# EAGLE design button_microcontroller_side (EAGLE 9.3.0)
PulcherButton 4.0 Microcontroller Side Jan Naef 190115
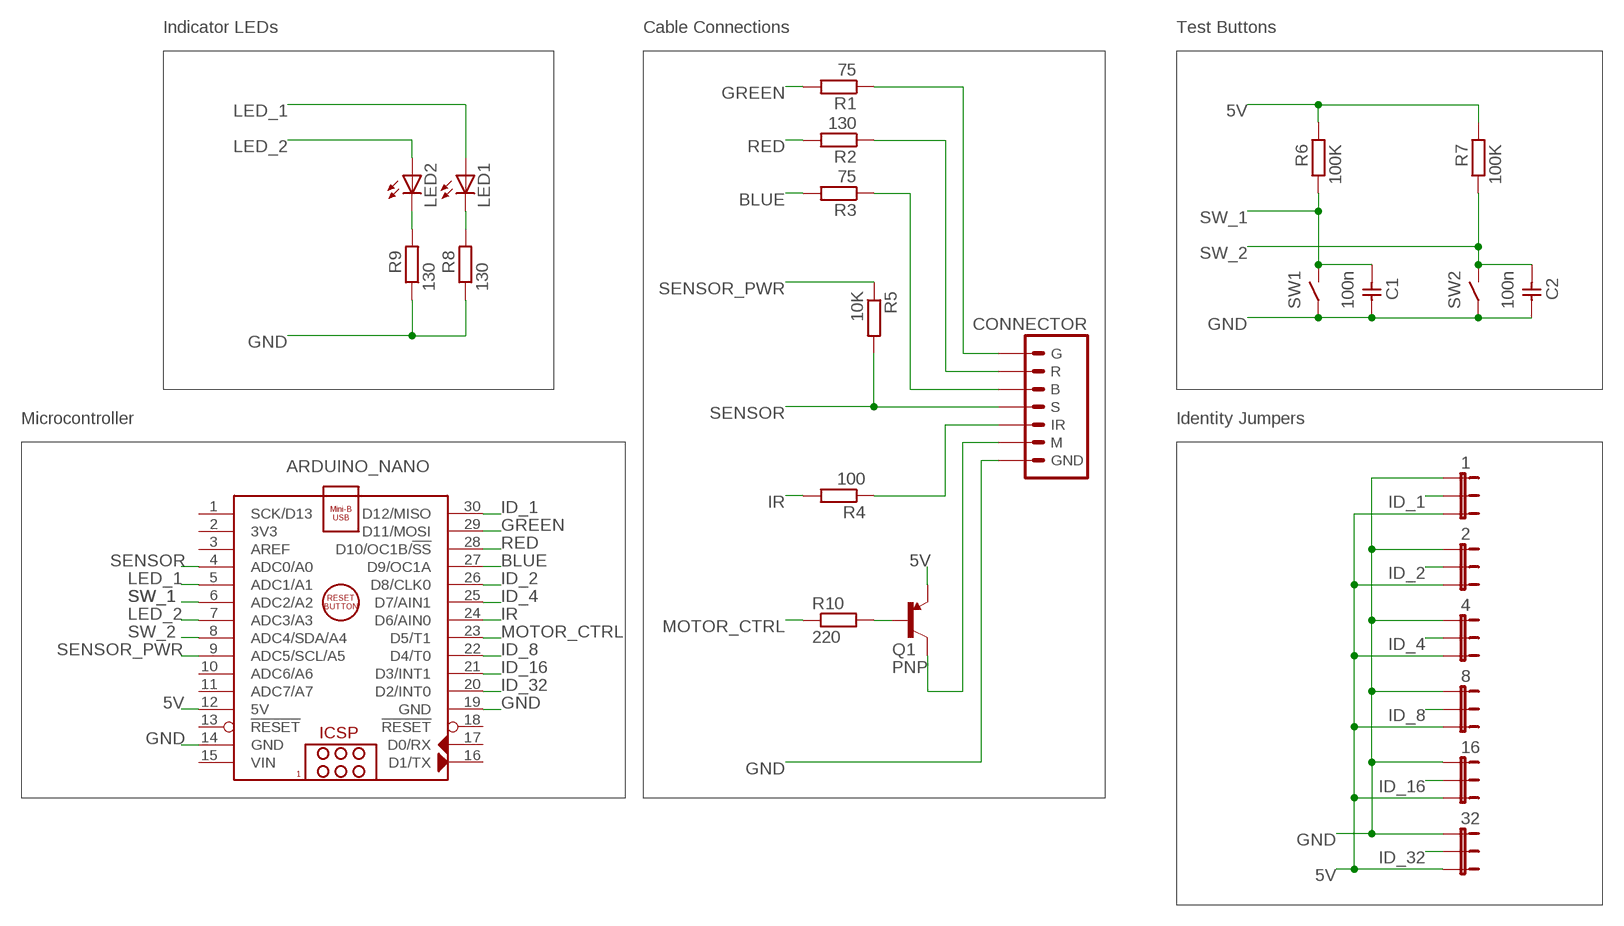
[diagram p0: schematic, sheet 1]

## Parts
1  JP2E  [JP2]
2  JP2E  [JP2]
4  JP2E  [JP2]
8  JP2E  [JP2]
16  JP2E  [JP2]
32  JP2E  [JP2]
ARDUINO_NANO  ARDUINO_NANO  [ARDUINO_NANO]
C1  100n  CAPACITOR  [CAPACITOR]
C2  100n  CAPACITOR  [CAPACITOR]
CONNECTOR  CONNECTOR_PADSHOLES  [CONNECTOR_ARDUINO_SIDE]
LED1  LED_3MM  [TCR5000_IR_EMITTER]
LED2  LED_3MM  [TCR5000_IR_EMITTER]
Q1  PNP  [TO92-]
R1  75  R-EU_0204/7  [0204/7]
R2  130  R-EU_0204/7  [0204/7]
R3  75  R-EU_0204/7  [0204/7]
R4  100  R-EU_0204/7  [0204/7]
R5  10K  R-EU_0204/7  [0204/7]
R6  100K  R-EU_0204/7  [0204/7]
R7  100K  R-EU_0204/7  [0204/7]
R8  130  R-EU_0204/7  [0204/7]
R9  130  R-EU_0204/7  [0204/7]
R10  220  R-EU_0204/7  [0204/7]
SW1  BUTTON  [KS-01Q-01_BUTTON]
SW2  BUTTON  [KS-01Q-01_BUTTON]

## Nets
5V: 1.3 2.3 4.3 8.3 16.3 32.3 ARDUINO_NANO.12(5V) Q1.E R6.2 R7.2
BLUE: ARDUINO_NANO.27(D9/OC1A) R3.2
GND: 1.1 2.1 4.1 8.1 16.1 32.1 ARDUINO_NANO.14(GND) ARDUINO_NANO.19(GND) C1.P$1 C2.P$1 CONNECTOR.GND R8.1 R9.1 SW1.1 SW1.3 SW2.1 SW2.3
GREEN: ARDUINO_NANO.29(D11/MOSI) R1.2
ID_1: 1.2 ARDUINO_NANO.30(D12/MISO)
ID_2: 2.2 ARDUINO_NANO.26(D8/CLK0)
ID_4: 4.2 ARDUINO_NANO.25(D7/AIN1)
ID_8: 8.2 ARDUINO_NANO.22(D4/T0)
ID_16: 16.2 ARDUINO_NANO.21(D3/INT1)
ID_32: 32.2 ARDUINO_NANO.20(D2/INT0)
IR: ARDUINO_NANO.24(D6/AIN0) R4.2
LED_1: ARDUINO_NANO.5(ADC1/A1) LED1.A
LED_2: ARDUINO_NANO.7(ADC3/A3) LED2.A
MOTOR [motor]: CONNECTOR.M Q1.C
MOTOR_CTRL: ARDUINO_NANO.23(D5/T1) R10.1
N$6: CONNECTOR.IR R4.1
N$7: CONNECTOR.B R3.1
N$8: CONNECTOR.R R2.1
N$14: CONNECTOR.G R1.1
N$19: LED1.C R8.2
N$20: LED2.C R9.2
N$21: Q1.B R10.2
RED: ARDUINO_NANO.28(D10/OC1B/!SS) R2.2
SENSOR: ARDUINO_NANO.4(ADC0/A0) CONNECTOR.S R5.2
SENSOR_PWR: ARDUINO_NANO.9(ADC5/SCL/A5) R5.1
SW_1: ARDUINO_NANO.6(ADC2/A2) C1.P$2 R6.1 SW1.2 SW1.4
SW_2: ARDUINO_NANO.8(ADC4/SDA/A4) C2.P$2 R7.1 SW2.2 SW2.4
Unconnected: ARDUINO_NANO.1(SCK/D13) ARDUINO_NANO.2(3V3) ARDUINO_NANO.3(AREF) ARDUINO_NANO.10(ADC6/A6) ARDUINO_NANO.11(ADC7/A7) ARDUINO_NANO.13(!RESET) ARDUINO_NANO.16(D1/TX) ARDUINO_NANO.17(D0/RX) ARDUINO_NANO.18(!RESET)

## Notes on the sheet
- Indicator LEDs | Cable Connections | Test Buttons
- Microcontroller | Identity Jumpers

## Power pins joined to a net without a drawn wire
VIN: ARDUINO_NANO.15(VIN)

## Library data of the parts
1 2 4 8 16 32 = Skinner_Box_Devices:JP2E: JUMPER
ARDUINO_NANO = Skinner_Box_Devices:ARDUINO_NANO: Arduino Nano V3.0 Module Overview: The Arduino Nano is a small, complete, and breadboard-friendly board based on the ATmega328 (Arduino Nano 3.x) or ATmega168 (Arduino Nano 2.x). It has more or less the same functionality of the Arduino Duemilanove, but in a different package. It lacks only a DC power jack, and works with a Mini-B USB cable instead of a standard one. The Nano was designed and is being produced by Gravitech <http://www.gravitech.us/arna30wiatp.html>. General specifications: Item Value Microcontroller Atmel ATmega168 or ATmega328 Operating Voltage (logic level) 5 V Input Voltage (recommended) 7-12 V Input Voltage (limits) 6-20 V Digital I/O Pins 14 (of which 6 provide PWM output) Analog Input Pins 8 DC Current per I/O Pin 40 mA Flash Memory 16 KB (ATmega168) or 32 KB (ATmega328) of which 2 KB used by bootloader SRAM 1 KB (ATmega168) or 2 KB (ATmega328) EEPROM 512 bytes (ATmega168) or 1 KB (ATmega328) Clock Speed 16 MHz Dimensions (Inches) 0.73" x 1.70" Dimensions (mm) 18mm x 45mm Overall height About 9 mm (not including pins) Weigth 5 g Power: The Arduino Nano can be powered via the Mini-B USB connection, 6-20V unregulated external power supply (pin 30), or 5V regulated external power supply (pin 27). The power source is automatically selected to the highest voltage source. Memory: The ATmega168 has 16 KB of flash memory for storing code (of which 2 KB is used for the bootloader); the ATmega328 has 32 KB, (also with 2 KB used for the bootloader). The ATmega168 has 1 KB of SRAM and 512 bytes of EEPROM (which can be read and written with the EEPROM library); the ATmega328 has 2 KB of SRAM and 1 KB of EEPROM. Input and Output: Each of the 14 digital pins on the Nano can be used as an input or output, using pinMode(), digitalWrite(), and digitalRead() functions. They operate at 5 volts. Each pin can provide or receive a maximum of 40 mA and has an internal pull-up resistor (disconnected by default) of 20-50 kOhms. In addition, some pins have specialized functions. Visit Arduino - ArduinoBoardNano <https://www.arduino.cc/en/Main/ArduinoBoardNano>
C1 C2 = Skinner_Box_Devices:CAPACITOR
CONNECTOR = Skinner_Box_Devices:CONNECTOR_PADS
LED1 LED2 = Skinner_Box_Devices:LED_3MM
Q1 = Skinner_Box_Devices:PNP: NPN Transistor
R1-R10 = Skinner_Box_Devices:R-EU_: RESISTOR, European symbol
SW1 SW2 = Skinner_Box_Devices:BUTTON

## Net classes
0 default: width 0.254 mm
1 motor: width 0.508 mm, clearance 0.254 mm

## Board
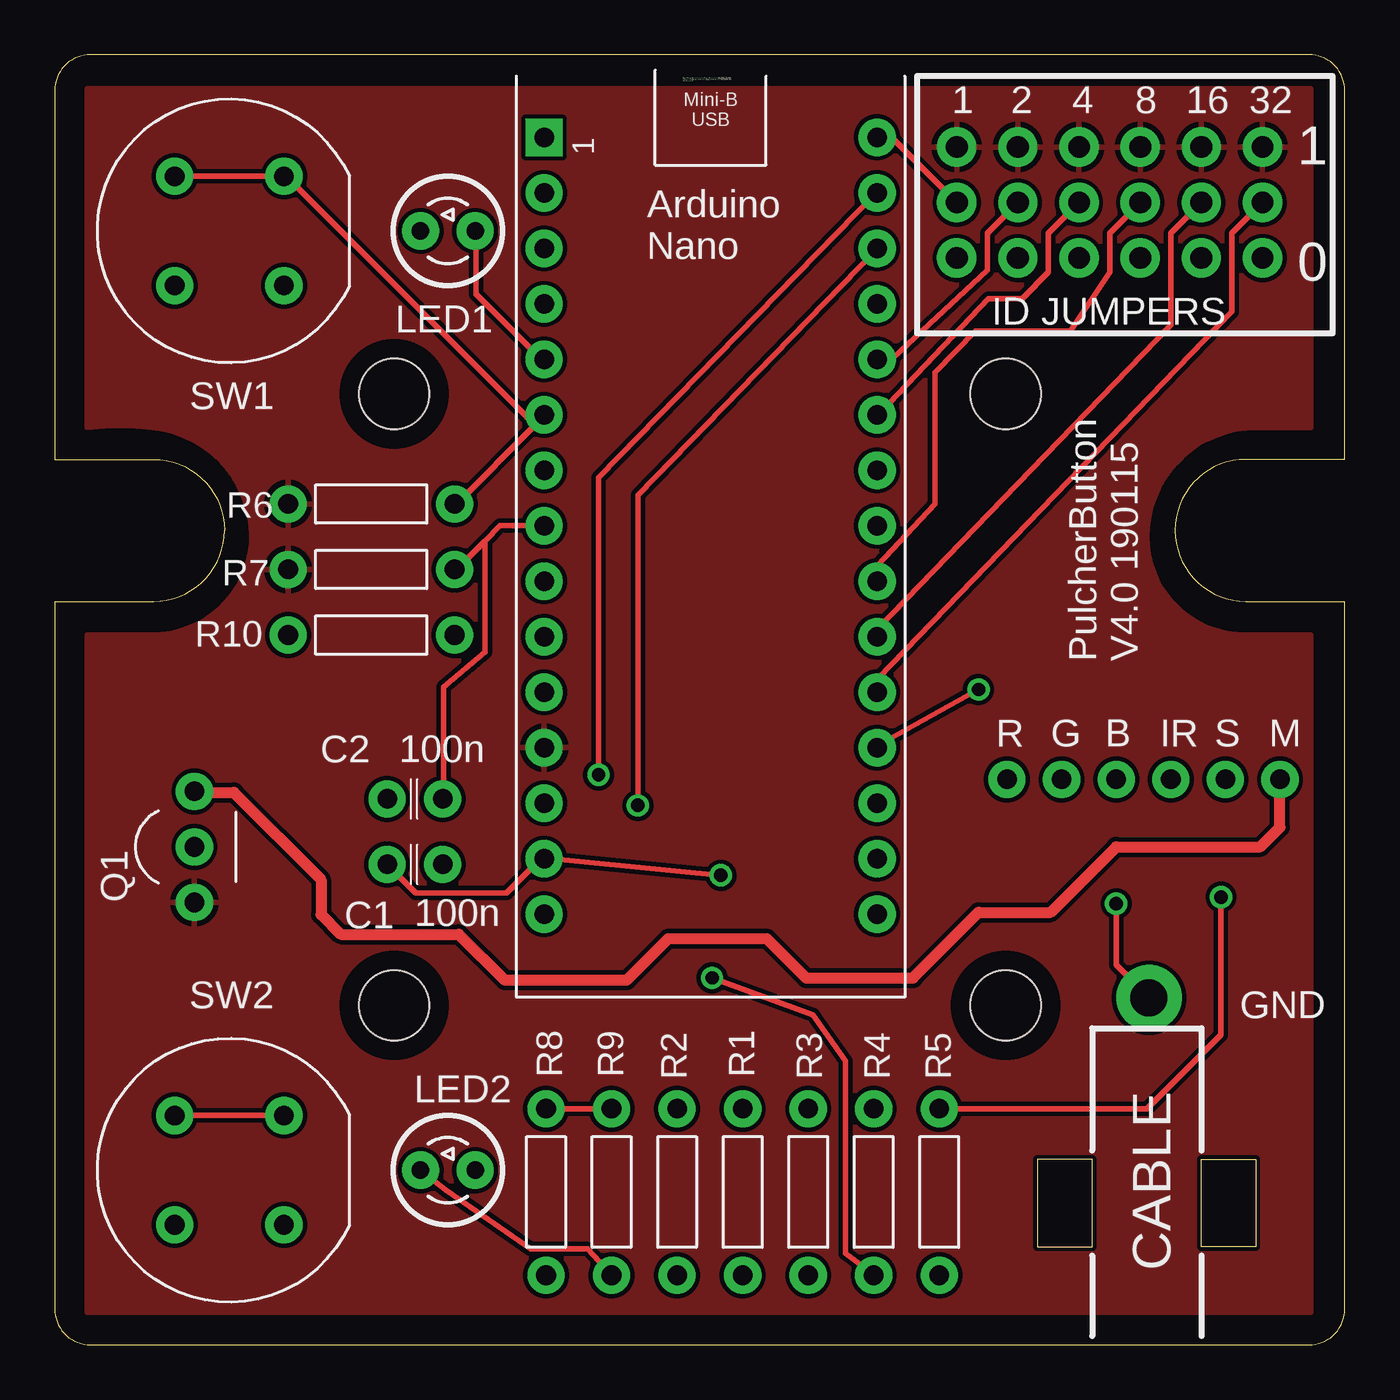
[diagram p1: board, top side]
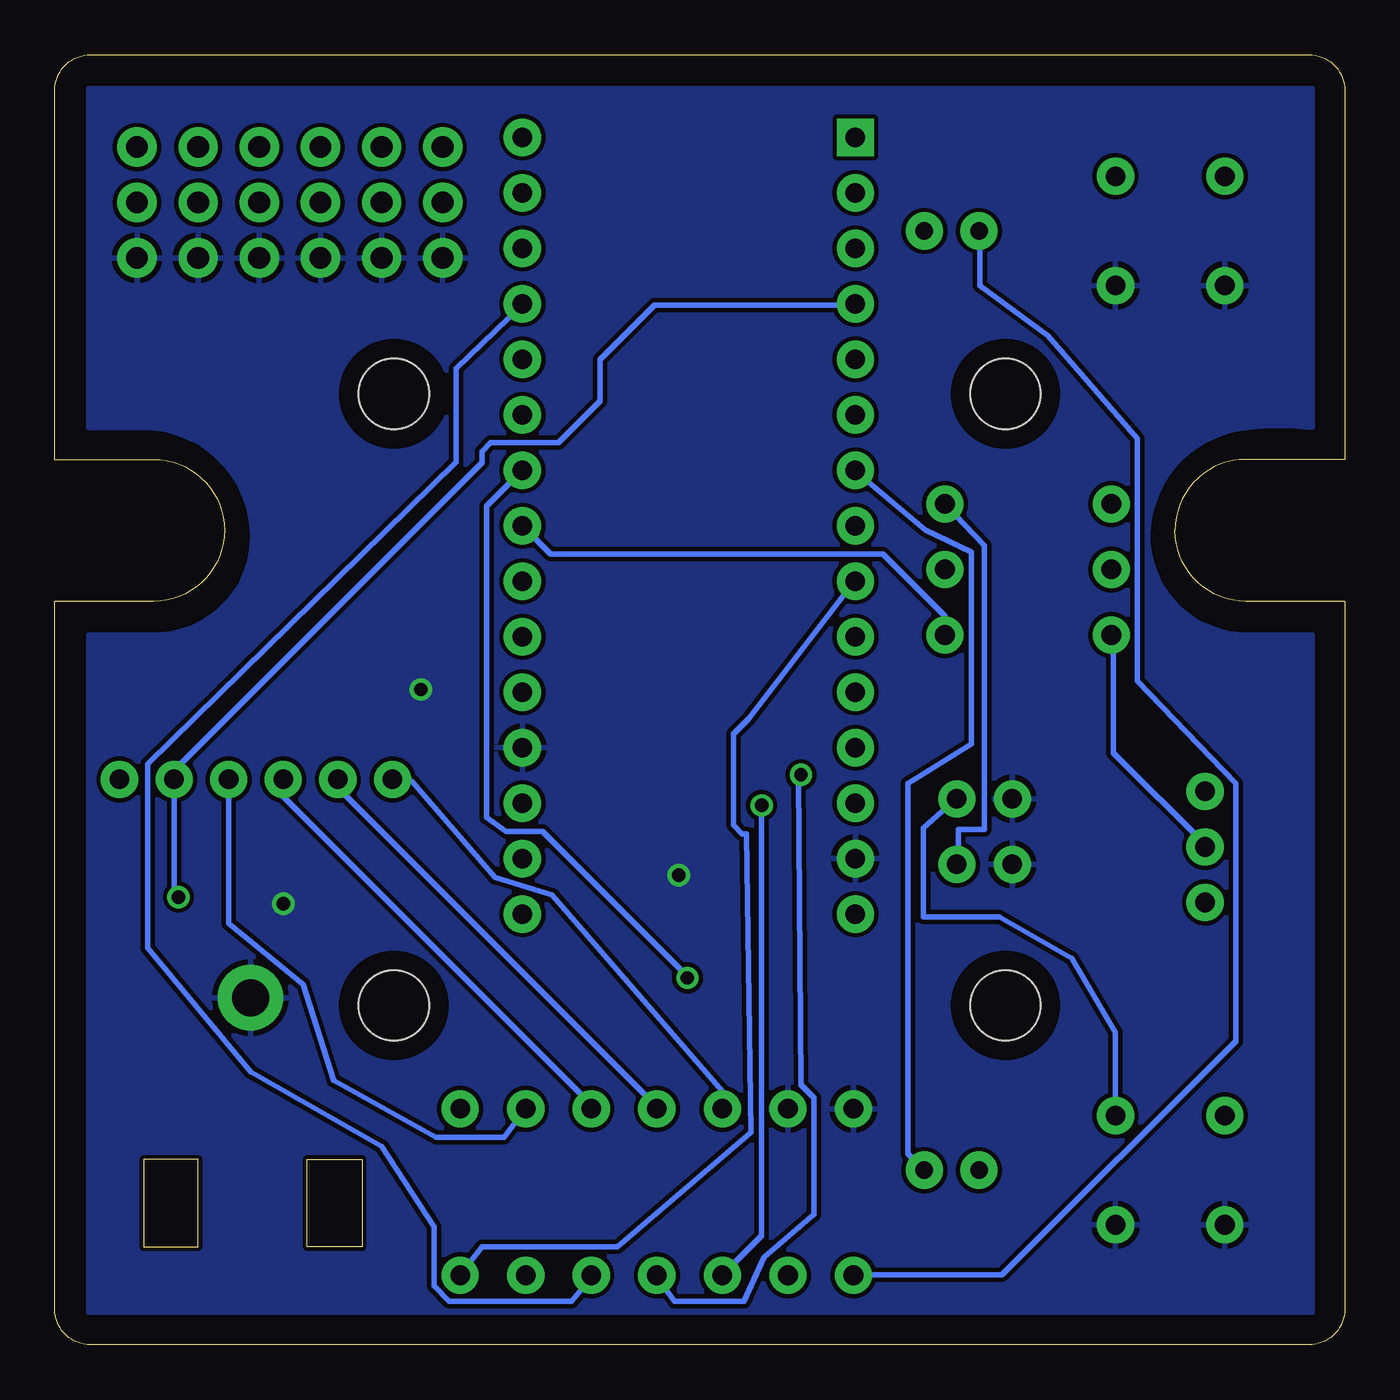
[diagram p2: board, bottom side, seen from below]

Size 59.07 x 59.07 mm. Coordinates in mm from the lower left corner, seen from the top.
Outline: 0,57.42 0,40.54 4.53,40.54 arc-90 7.78,37.29 arc-90 4.53,34.04 0,34.04 0,1.65 arc90 1.65,0 57.42,0 arc90 59.07,1.65 59.07,34.04 54.54,34.04 arc-90 51.29,37.29 arc-90 54.54,40.54 59.07,40.54 59.07,57.42 arc90 57.42,59.07 1.65,59.07 arc90 0,57.42
Outline: 47.5,8.5 45,8.5 45,4.5 47.5,4.5 47.5,8.5
Outline: 52.5,8.5 55,8.5 55,4.5 52.5,4.5 52.5,8.5
Copper layers (1*16): Top 0.035mm / dielectric 1.5mm / Bottom 0.035mm
Design rules "eagle_design_rules_multiCB": minimum track width 0.2mm, minimum drill 0.2mm, track to track 0.2mm, track to pad 0.2mm, pad to pad 0.2mm, via to via 0.2mm, smd to smd 0.2mm, copper to edge 0.2mm, drill to drill 0.2mm, minimum pad ring 0mil, minimum via ring 8mil, stop-mask expansion 4mil, vias tented up to drill 1mm, thermal gap 10mil
Holes 3.2 mm at 15.54,15.54 43.54,43.54 15.54,43.54 43.54,15.54
tKeepout: area 44.7,4.2 to 47.8,8.8; area 52.2,4.2 to 55.3,8.8
bKeepout: area 44.7,4.2 to 47.8,8.8; area 52.2,4.2 to 55.3,8.8
tRestrict: area 13,41 to 18,46; area 41,41 to 46,46; area 41,13 to 46,18; area 13,13 to 18,18
bRestrict: area 13,41 to 18,46; area 41,41 to 46,46; area 41,13 to 46,18; area 13,13 to 18,18

### Footprints (pad centres in the part's own frame; a part is rotated, then mirrored left to right if it is on the bottom)
JP2 = drill 1 pad 1.8: 1 -2.54,0; 2 0,0; 3 2.54,0
ARDUINO_NANO = drill 0.9 pad 1.7 square: 1 -20.32,-7.62 | drill 0.9 pad 1.7: 2 -17.78,-7.62; 3 -15.24,-7.62; 4 -12.7,-7.62; 5 -10.16,-7.62; 6 -7.62,-7.62; 7 -5.08,-7.62; 8 -2.54,-7.62; 9 0,-7.62; 10 2.54,-7.62; 11 5.08,-7.62; 12 7.62,-7.62; 13 10.16,-7.62; 14 12.7,-7.62; 15 15.24,-7.62; 16 15.24,7.62; 17 12.7,7.62; 18 10.16,7.62; 19 7.62,7.62; 20 5.08,7.62; 21 2.54,7.62; 22 0,7.62; 23 -2.54,7.62; 24 -5.08,7.62; 25 -7.62,7.62; 26 -10.16,7.62; 27 -12.7,7.62; 28 -15.24,7.62; 29 -17.78,7.62; 30 -20.32,7.62
CAPACITOR = drill 0.9 pad 1.7: P$1 -1.27,0; P$2 1.27,0
CONNECTOR_ARDUINO_SIDE = drill 0.9 pad 1.7: B -1.5,10; G -4,10; IR 1,10; M 6,10; R -6.5,10; S 3.5,10 | drill 1.7 pad 3: GND 0,0
TCR5000_IR_EMITTER = drill 0.8 pad 1.7: A 0,1.25; C 0,-1.25
TO92- = drill 0.9 pad 1.7: B 0,0; C 2.54,0; E -2.54,0
0204/7 = drill 0.9 pad 1.7: 1 -3.81,0; 2 3.81,0
KS-01Q-01_BUTTON = drill 0.9 pad 1.7: 1 -2.5,-2.5; 2 2.5,-2.5; 3 -2.5,2.5; 4 2.5,2.5

### Placement (x,y rotation side)
1  41.3,52.3 90 top
2  44.1,52.3 90 top
4  46.9,52.3 90 top
8  49.7,52.3 90 top
16  52.5,52.3 90 top
32  55.3,52.3 90 top
ARDUINO_NANO  30.04,34.96 270 top
C1  16.5,22 0 top
C2  16.5,25 0 top
CONNECTOR  50.1,15.89 0 top
LED1  18,51 270 top
LED2  18,8 270 top
Q1  6.4,22.8 90 top
R1  31.5,7 270 top
R2  28.5,7 270 top
R3  34.5,7 270 top
R4  37.5,7 270 top
R5  40.5,7 90 top
R6  14.5,38.5 180 top
R7  14.5,35.5 180 top
R8  22.5,7 270 top
R9  25.5,7 270 top
R10  14.5,32.5 180 top
SW1  8,51 90 top
SW2  8,8 90 top

### Tracks (layer width: path | path; a pad name or v marks a point on that pad's centre or on a via)
5V
  pour Top: 1.5,1.5 1.5,32.5 4.5,32.5 arc96 9,37.5 arc78 4.5,42 arc12 1.5,42 1.5,57.5 57.5,57.5 57.5,42 55,42 arc90 50,37 arc90 54.5,32.5 57.5,32.5 57.5,1.5
BLUE
  Bottom 0.254: ARDUINO_NANO.27 37.7,47.6 37.7,47.59 40.7,44.69 40.7,40.4 54.8,26.6 54.8,18.18 50.1,12.5 44.1,9.1 41.7,5.4 41.7,2.7 41,2 35.4,2 34.5,3.1 R3.2
GND  (via drill 0.61)
  Top 0.254: R8.1 R9.1 | C1.P$1 16.53,20.7 20.7,20.7 22.26,22.26 ARDUINO_NANO.14 | CONNECTOR.GND 48.6,17.39 v48.6,20.2 | v30.5,21.5 22.4,22.3 | 37.6,27.4 v42.3,30
  pour Bottom: 1.5,1.5 1.5,32.5 4.5,32.5 arc96 9,37.5 arc78 4.5,42 arc12 1.5,42 1.5,57.5 57.5,57.5 57.5,42 55,42 arc90 50,37 arc90 54.5,32.5 57.5,32.5 57.5,1.5
GREEN  (via drill 0.61)
  Top 0.254: ARDUINO_NANO.29 37.62,52.74 24.9,39.7 v24.9,26.1
  Bottom 0.254: v24.9,26.1 25.01,25.98 24.9,11.9 24.3,11.3 24.3,5.99 26.6,4 27.5,2 30.7,2 31.5,3.1 R1.2
ID_1
  Top 0.254: 1.2 38.4,55.2 37.7,55.2 ARDUINO_NANO.30
ID_2
  Top 0.254: 2.2 42.7,50.9 42.7,49.2 38.4,45.2 37.7,45.2 ARDUINO_NANO.26
ID_4
  Top 0.254: 4.2 45.5,50.9 45.5,49.1 44.3,47.9 42.75,47.9 38.2,43.1 37.7,42.6 ARDUINO_NANO.25
ID_8
  Top 0.254: 8.2 48.3,50.9 48.3,49.1 46.5,46.4 42.15,46.4 40.3,44.5 40.3,38.5 37.7,35.7 37.7,35 ARDUINO_NANO.22
ID_16
  Top 0.254: 16.2 51.1,50.9 51.1,46.69 37.7,32.79 37.7,32.5 ARDUINO_NANO.21
ID_32
  Top 0.254: 32.2 53.9,50.9 53.9,47.3 37.7,30.5 37.7,29.9 ARDUINO_NANO.20
IR  (via drill 0.61)
  Top 0.254: v30.1,16.8 34.72,15.12 36.2,13 36.2,4.2 R4.2
  Bottom 0.254: ARDUINO_NANO.24 39.3,38.4 39.3,24.14 38.4,23.5 36.73,23.5 30.1,16.87 v30.1,16.8
LED_1
  Top 0.254: ARDUINO_NANO.5 22.28,45.12 19.3,48.1 19.3,51 LED1.A
LED_2
  Bottom 0.254: LED2.A 20,8.75 20,25.7 17.1,27.5 17.1,36.3 19.2,37.3 22.4,40 ARDUINO_NANO.7
MOTOR
  Top 0.508: Q1.C 6.4,25.3 8.2,25.3 12.2,21.3 12.2,19.7 13.1,18.8 18.5,18.8 20.6,16.7 26.2,16.7 28.1,18.6 32.6,18.6 34.4,16.8 39.3,16.8 42.3,19.8 45.6,19.8 48.6,22.8 55.2,22.8 56.1,23.7 CONNECTOR.M
MOTOR_CTRL
  Bottom 0.254: ARDUINO_NANO.23 36.35,36.2 21.14,36.2 18.31,33.37 R10.1
N$6
  Bottom 0.254: CONNECTOR.IR 51.1,19.3 47.7,16.5 46.3,12.1 41.6,9.5 38.5,9.5 R4.1
N$7
  Bottom 0.254: CONNECTOR.B 48.6,25.1 34.5,11 R3.1
N$8
  Bottom 0.254: R2.1 28.5,11.6 36.3,20.6 38.9,21.4 42.7,25.8 43.6,25.8 CONNECTOR.R
N$14
  Bottom 0.254: CONNECTOR.G 46.1,25.5 31.5,10.9 R1.1
N$19
  Bottom 0.254: LED1.C 16.7,51 16.7,48.5 13.6,46.2 9.5,41.5 9.5,30.4 5,25.7 5,13.9 15.7,3.2 R8.2
N$20
  Top 0.254: LED2.C 17.9,7.1 21.8,4.4 24.4,4.4 R9.2
N$21
  Bottom 0.254: Q1.B 6.4,22.9 10.6,27.1 10.6,32.5 R10.2
RED  (via drill 0.61)
  Top 0.254: v26.7,24.7 26.7,38.91 37.6,50.11 37.6,50.2 ARDUINO_NANO.28
  Bottom 0.254: v26.7,24.7 26.7,5 R2.2
SENSOR  (via drill 0.61)
  Top 0.254: R5.2 50.01,10.81 53.4,14.2 v53.4,20.5
  Bottom 0.254: ARDUINO_NANO.4 22.5,47.6 31.6,47.6 34.1,45.1 34.1,43.2 36,41.3 39.1,41.3 39.5,40.9 39.5,40.4 53.6,26.3 CONNECTOR.S 53.6,20.7 v53.4,20.5
SENSOR_PWR
  Bottom 0.254: ARDUINO_NANO.9 22.5,34.9 27.3,28.66 28,27.96 28,23.8 27.6,23.4 27.4,23.4 27.2,9.73 33.3,4.5 39.5,4.5 R5.1
SW_1
  Top 0.254: SW1.4 SW1.2 10.6,53.5 22,42.1 | 22,42.1 18.4,38.5 R6.1 | 22,42.1 22.4,42.5 ARDUINO_NANO.6
  Bottom 0.254: C1.P$2 17.7,22 17.7,23.6 16.5,23.6 16.5,36.59 R6.1
SW_2
  Top 0.254: SW2.2 SW2.4 | ARDUINO_NANO.8 20.4,37.5 19.7,36.8 | 19.7,36.8 18.4,35.5 R7.1 | 19.7,36.8 19.7,31.72 17.8,30.12 17.8,25 C2.P$2
  Bottom 0.254: SW2.2 10.5,14.3 12.5,17.7 15.82,19.6 19.3,19.6 19.3,23.67 17.8,25 C2.P$2

### Text on the board
tPlace: 1 / / 0 | ID JUMPERS | PulcherButton / V4.0 190115 | CABLE